# EAGLE design Main (EAGLE 6.5.0)
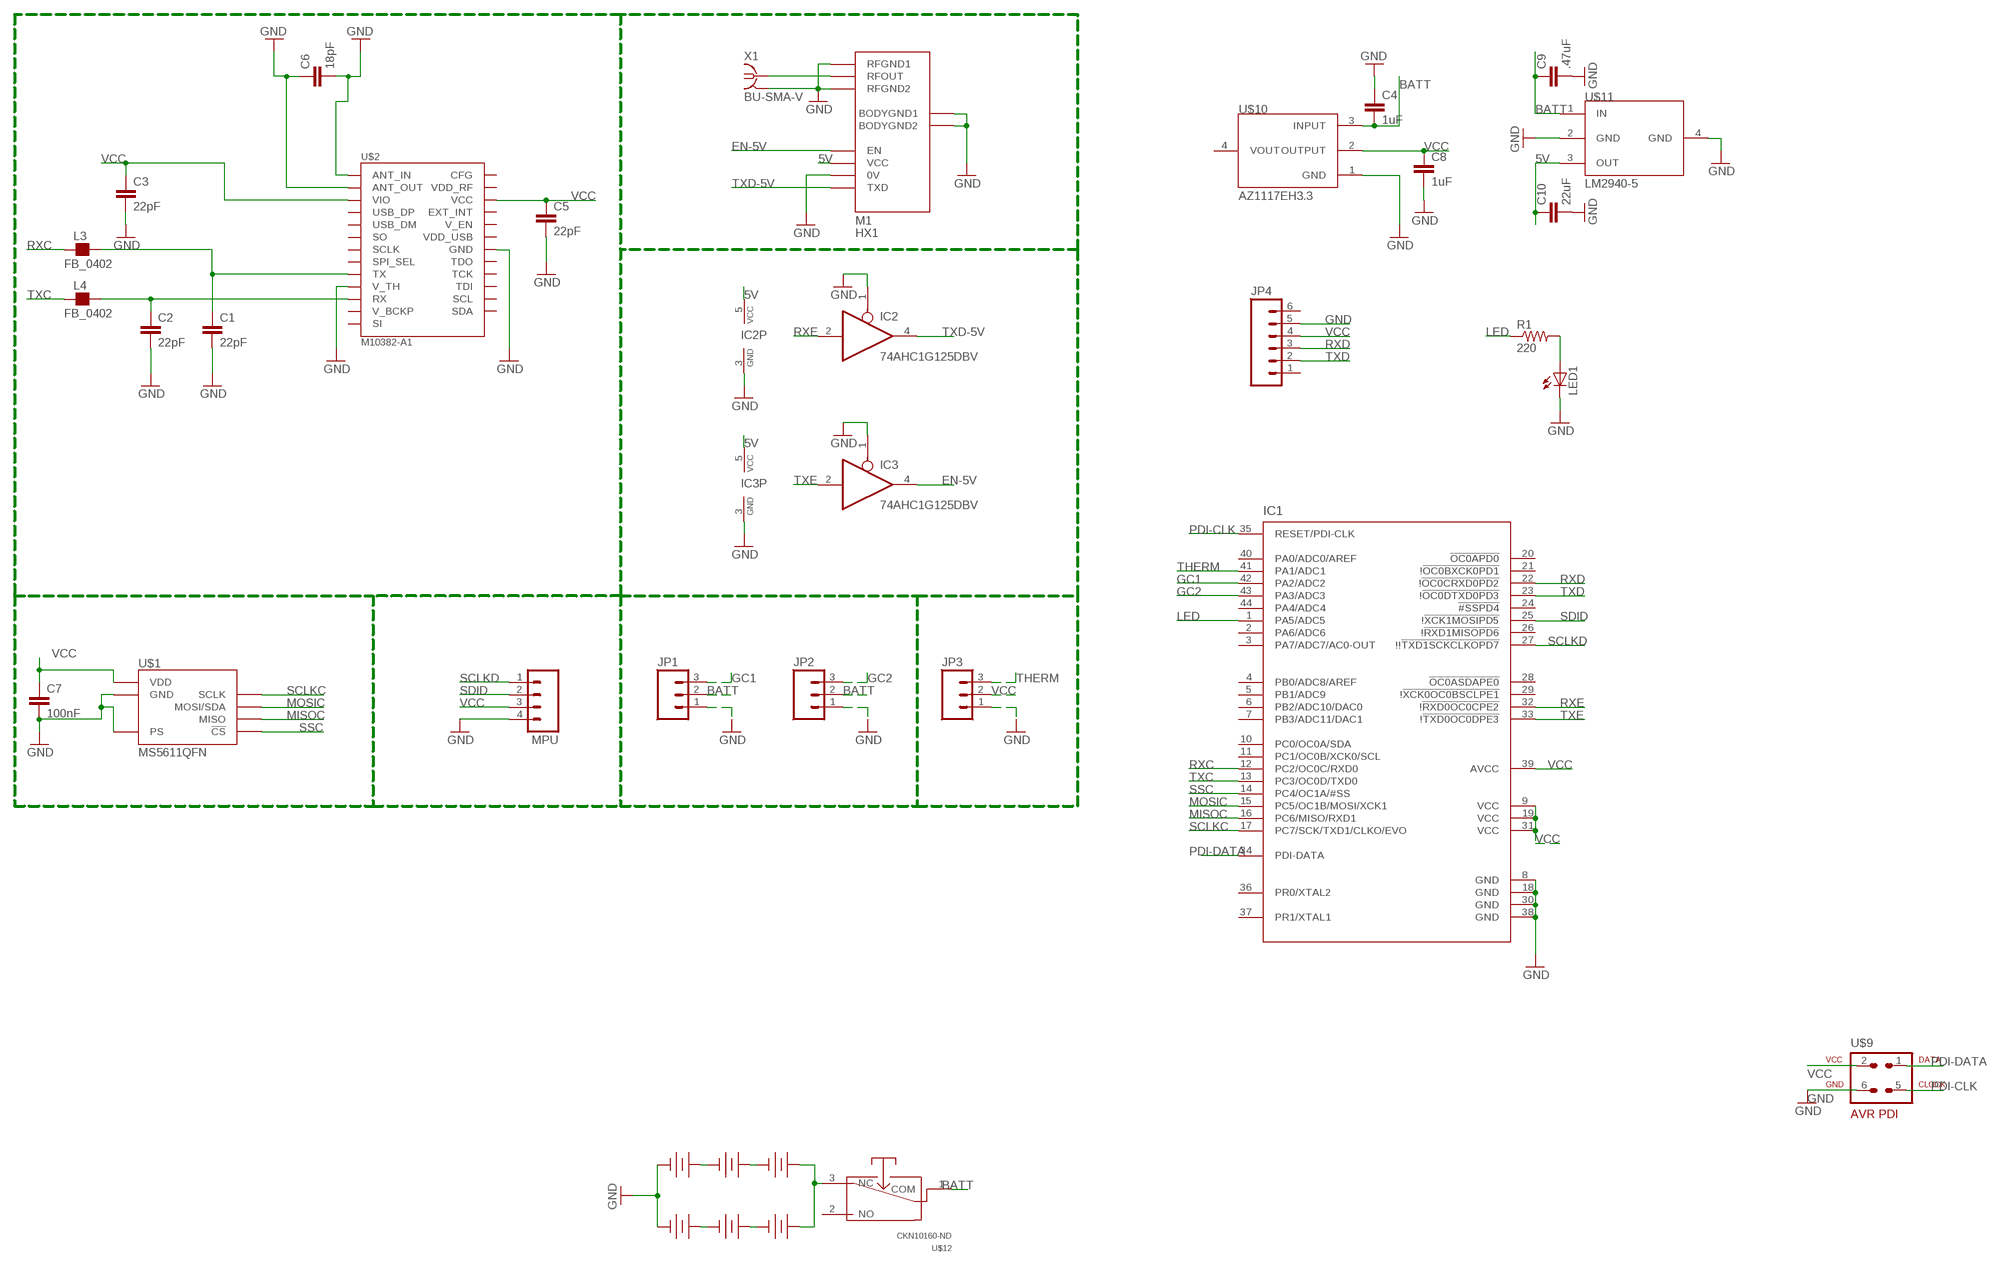
[diagram p0: schematic, sheet 1]

## Parts
C1  22pF  CAP0805  [0805]
C2  22pF  CAP0805  [0805]
C3  22pF  CAP0805  [0805]
C4  1uF  CAP0603-CAP  [0603-CAP]
C5  22pF  CAP0805  [0805]
C6  18pF  CAP0805  [0805]
C7  100nF  CAP0805  [0805]
C8  1uF  CAP0603-CAP  [0603-CAP]
C9  .47uF  CAP0603-CAP  [0603-CAP]
C10  22uF  CAP0603-CAP  [0603-CAP]
IC1  AT-XMEGA-XXA4-AU  [QFP80P1200X1200X120-44N]
IC2  74AHC1G125DBV  [SOT23-5]
IC3  74AHC1G125DBV  [SOT23-5]
JP1  M03JST-PTH  [JST-3-PTH]
JP2  M03JST-PTH  [JST-3-PTH]
JP3  M03JST-PTH  [JST-3-PTH]
JP4  M06POLAR  [MOLEX-1X6]
L3  FB_0402  [L0402]
L4  FB_0402  [L0402]
LED1  LEDCHIP-LED0603  [CHIP-LED0603]
M1  HX1  [HX1]
MPU  M04  [04P]
R1  220  R-US_R0603  [R0603]
U$1  MS5611QFN  [MS5611-01BA01]
U$2  M10382-A1  [M10382-A1]
U$3  123_BATTERY_HOLDERCR-123-A  [CR-123-A_HOLDER]
U$4  123_BATTERY_HOLDERCR-123-A  [CR-123-A_HOLDER]
U$5  123_BATTERY_HOLDERCR-123-A  [CR-123-A_HOLDER]
U$6  123_BATTERY_HOLDERCR-123-A  [CR-123-A_HOLDER]
U$7  123_BATTERY_HOLDERCR-123-A  [CR-123-A_HOLDER]
U$8  123_BATTERY_HOLDERCR-123-A  [CR-123-A_HOLDER]
U$9  AVR-PDIVERT  [AVR-ISP-6]
U$10  AZ1117EH3.3  [SOT-223]
U$11  LM2940-5  [SOT-223]
U$12  CKN10160-ND  [ZMCHFL3R]
X1  BU-SMA-V  [BU-SMA-V]

## Nets
5V: C10.1 IC2.5(VCC) IC3.5(VCC) M1.VCC U$11.3(OUT)
BATT: C4.2 C9.1 JP1.2 JP2.2 U$10.3(INPUT) U$11.1(IN) U$12.1(COM)
EN-5V: IC3.4(O) M1.EN
GC1: IC1.42(PA2/ADC2) JP1.3
GC2: IC1.43(PA3/ADC3) JP2.3
GND: C1.2 C2.2 C3.2 C4.1 C5.2 C6.1 C6.2 C7.2 C8.2 C9.2 C10.2 IC1.8(GND) IC1.18(GND) IC1.30(GND) IC1.38(GND) IC2.1(OE) IC2.3(GND) IC3.1(OE) IC3.3(GND) JP1.1 JP2.1 JP3.1 JP4.5 LED1.C M1.0V M1.BODYGND1 M1.BODYGND2 M1.RFGND1 M1.RFGND2 MPU.4 U$1.2(PS) U$1.3(GND) U$2.1(ANT_IN) U$2.2(GND) U$2.3(ANT_OUT) U$2.4(GND) U$2.12(V_TH) U$2.14(GND) U$2.17(GND) U$2.21(GND) U$2.24(GND) U$2.26(GND) U$2.28(GND) U$2.33(GND) U$2.34(GND) U$2.35(GND) U$2.36(GND) U$3.- U$6.- U$9.6 U$10.1(GND) U$11.2(GND) U$11.4(GND) X1.2(GND)
LED: IC1.1(PA5/ADC5) R1.1
MISOC: IC1.16(PC6/MISO/RXD1) U$1.6(MISO)
MOSIC: IC1.15(PC5/OC1B/MOSI/XCK1) U$1.7(MOSI/SDA)
N$1: C1.1 L3.2 U$2.11(TX)
N$2: C2.1 L4.2 U$2.13(RX)
N$4: U$3.+ U$4.-
N$5: M1.RFOUT X1.1
N$6: U$4.+ U$5.-
N$7: U$5.+ U$8.+ U$12.3(NC)
N$8: U$6.+ U$7.-
N$9: U$7.+ U$8.-
N$11: LED1.A R1.2
PDI-CLK: IC1.35(RESET/PDI-CLK) U$9.5
PDI-DATA: IC1.34(PDI-DATA) U$9.1
RXC: IC1.12(PC2/OC0C/RXD0) L3.1
RXD: IC1.22(!!OC0CRXD0PD2) JP4.3
RXE: IC1.32(!!RXD0OC0CPE2) IC2.2(I)
SCLKC: IC1.17(PC7/SCK/TXD1/CLKO/EVO) U$1.8(SCLK)
SCLKD: IC1.27(!!!TXD1SCKCLKOPD7) MPU.1
SDID: IC1.25(!!XCK1MOSIPD5) MPU.2
SSC: IC1.14(PC4/OC1A/#SS) U$1.4(!CS!) U$1.5(!CS!)
THERM: IC1.41(PA1/ADC1) JP3.3
TXC: IC1.13(PC3/OC0D/TXD0) L4.1
TXD: IC1.23(!!OC0DTXD0PD3) JP4.2
TXD-5V: IC2.4(O) M1.TXD
TXE: IC1.33(!!TXD0OC0DPE3) IC3.2(I)
VCC: C3.1 C5.1 C7.1 C8.1 IC1.9(VCC) IC1.19(VCC) IC1.31(VCC) IC1.39(AVCC) JP3.2 JP4.4 MPU.3 U$1.1(VDD) U$2.5(VIO) U$2.27(VCC) U$9.2 U$10.2(OUTPUT)
Unconnected: IC1.2(PA6/ADC6) IC1.3(PA7/ADC7/AC0-OUT) IC1.4(PB0/ADC8/AREF) IC1.5(PB1/ADC9) IC1.6(PB2/ADC10/DAC0) IC1.7(PB3/ADC11/DAC1) IC1.10(PC0/OC0A/SDA) IC1.11(PC1/OC0B/XCK0/SCL) IC1.20(!OC0APD0) IC1.21(!!OC0BXCK0PD1) IC1.24(!#SSPD4) IC1.26(!!RXD1MISOPD6) IC1.28(!OC0ASDAPE0) IC1.29(!!XCK0OC0BSCLPE1) IC1.36(PR0/XTAL2) IC1.37(PR1/XTAL1) IC1.40(PA0/ADC0/AREF) IC1.44(PA4/ADC4) JP4.1 JP4.6 U$2.6(USB_DP) U$2.7(USB_DM) U$2.8(SO) U$2.9(SCLK) U$2.10(SPI_SEL) U$2.15(V_BCKP) U$2.16(SI) U$2.18(SDA) U$2.19(SCL) U$2.20(TDI) U$2.22(TCK) U$2.23(TDO) U$2.25(VDD_RF) U$2.29(EXT_INT) U$2.30(V_EN) U$2.31(CFG) U$2.32(VDD_USB) U$10.4(VOUT) U$12.2(NO)

## Power pins joined to a net without a drawn wire
GND: X1.3(GND) X1.4(GND) X1.5(GND)

## Library data of the parts
C1-C10 = SparkFun:CAP: Capacitor Standard 0603 ceramic capacitor, and 0.1" leaded capacitor.
IC1 = xmega-a4:AT-XMEGA-XXA4-AU: ATxMega a4 Serie
IC2 IC3 = 74xx-little-us:74*1G125: Single Bus Buffer Gate with 3-State Output
JP1-JP3 = SparkFun-Connectors:M03: Header 3 Standard 3-pin 0.1" header. Use with straight break away headers (SKU : PRT-00116), right angle break away headers (PRT-00553), swiss pins (PRT-00743), machine pins (PRT-00117), and female headers (PRT-00115). Molex polarized connector foot print use with SKU : PRT-08232 with associated crimp pins and housings.
JP4 = SparkFun:M06: Header 6 Standard 6-pin 0.1" header. Use with straight break away headers (SKU : PRT-00116), right angle break away headers (PRT-00553), swiss pins (PRT-00743), machine pins (PRT-00117), and female headers (PRT-00115). Molex polarized connector foot print use with SKU : PRT-08094 with associated crimp pins and housings. NOTES ON THE VARIANTS LOCK and LOCK_LONGPADS... This footprint was designed to help hold the alignment of a through-hole component (i.e. 6-pin header) while soldering it into place. You may notice that each hole has been shifted either up or down by 0.005 of an inch from it's more standard position (which is a perfectly straight line). This slight alteration caused the pins (the squares in the middle) to touch the edges of the holes. Because they are alternating, it causes a "brace" to hold the component in place. 0.005 has proven to be the perfect amount of "off-center" position when using our standard breakaway headers. Although looks a little odd when you look at the bare footprint, once you have a header in there, the alteration is very hard to notice. Also, if you push a header all the way into place, it is covered up entirely on the bottom side. This idea of altering the position of holes to aid alignment will be further integrated into the Sparkfun Library for other footprints. It can help hold any component with 3 or more connection pins.
L3 L4 = rc-master-smd:FB_: FERRITE BEAD
LED1 = led:LED: LED OSRAM: - CHIPLED LG R971, LG N971, LY N971, LG Q971, LY Q971, LO R971, LY R971 LH N974, LH R974 LS Q976, LO Q976, LY Q976 LO Q996 - Hyper CHIPLED LW Q18S LB Q993, LB Q99A, LB R99A - SideLED LS A670, LO A670, LY A670, LG A670, LP A670 LB A673, LV A673, LT A673, LW A673 LH A674 LY A675 LS A676, LA A676, LO A676, LY A676, LW A676 LS A679, LY A679, LG A679 - Hyper Micro SIDELED® LS Y876, LA Y876, LO Y876, LY Y876 LT Y87S - SmartLED LW L88C, LW L88S LB L89C, LB L89S, LG L890 LS L89K, LO L89K, LY L89K LS L896, LA L896, LO L896, LY L896 - TOPLED LS T670, LO T670, LY T670, LG T670, LP T670 LSG T670, LSP T670, LSY T670, LOP T670, LYG T670 LG T671, LOG T671, LSG T671 LB T673, LV T673, LT T673, LW T673 LH T674 LS T676, LA T676, LO T676, LY T676, LB T676, LH T676, LSB T676, LW T676 LB T67C, LV T67C, LT T67C, LS T67K, LO T67K, LY T67K, LW E67C LS E67B, LA E67B, LO E67B, LY E67B, LB E67C, LV E67C, LT E67C LW T67C LS T679, LY T679, LG T679 LS T770, LO T770, LY T770, LG T770, LP T770 LB T773, LV T773, LT T773, LW T773 LH T774 LS E675, LA E675, LY E675, LS T675 LS T776, LA T776, LO T776, LY T776, LB T776 LHGB T686 LT T68C, LB T68C - Hyper Mini TOPLED® LB M676 - Mini TOPLED Santana® LG M470 LS M47K, LO M47K, LY M47K Source: http://www.osram.convergy.de LUXEON: - LUMILED® LXK2-PW12-R00, LXK2-PW12-S00, LXK2-PW14-U00, LXK2-PW14-V00 LXK2-PM12-R00, LXK2-PM12-S00, LXK2-PM14-U00 LXK2-PE12-Q00, LXK2-PE12-R00, LXK2-PE12-S00, LXK2-PE14-T00, LXK2-PE14-U00 LXK2-PB12-K00, LXK2-PB12-L00, LXK2-PB12-M00, LXK2-PB14-N00, LXK2-PB14-P00, LXK2-PB14-Q00 LXK2-PR12-L00, LXK2-PR12-M00, LXK2-PR14-Q00, LXK2-PR14-R00 LXK2-PD12-Q00, LXK2-PD12-R00, LXK2-PD12-S00 LXK2-PH12-R00, LXK2-PH12-S00 LXK2-PL12-P00, LXK2-PL12-Q00, LXK2-PL12-R00 Source: www.luxeon.com KINGBRIGHT: KA-3528ASYC Source: www.kingbright.com
M1 = trackuino:HX1
MPU = con-amp-quick:M04: AMP QUICK CONNECTOR; OC_FARNELL: unknown; OC_NEWARK: unknown
R1 = rcl:R-US_: RESISTOR, American symbol
U$1 = SHC:MS5611
U$2 = SHC:M10382-A1: Antenova’s GPS RADIONOVA® M10382 is a single package solution that combines a full GPS engine and antenna on a small SMD module. The M10382 is a highly integrated GPS RF Antenna Module suitable for L1-band GPS and A-GPS systems. The device combines the high performance u-blox 6 GPS position engine with Antenova’s high efficiency antenna technology in a small SMD module. M10382 also benefits from novel external matching that ensures easy tuning for each platform. All front-end and receiver components are contained in a single package laminate base module, providing a complete GPS receiver for optimum performance. The M10382 operates on 1.8V or 3.3V positive supply with low power consumption and several low power modes for further power savings. An accurate 0.5ppm TCXO and very low noise LNA ensures high sensitivity and short TTFF. The M10382 is supported by u-blox stand alone software and is compatible with UART, SPI, DDC, I2C and USB host processor interfaces.
U$3-U$8 = SHC:123_BATTERY_HOLDER
U$9 = avr-7:AVR-PDI: AVR PDI programming interface connector
U$10 = Physoon:AZ1117EH
U$11 = Physoon:LM2940
U$12 = SHC:CKN10160-ND: CONTACT RATING: F7: 3A @ 125 VAC ELECTRICAL LIFE: 15,000 Cycles. @ 3A INSULATION RESISTANCE: 100 M ohm min. DIELECTRIC STRENGTH: 1000 Vrms. OPERATING TEMPERATURE: ?30ºC to 85ºC. OPERATING FORCE: CJ: 150 grams, CH: 90 grams.
X1 = con-coax:BU-SMA-V: FEMALE SMA CONNECTOR Radiall distributor RS 112-3794; OC_FARNELL: unknown; OC_NEWARK: unknown

## Board
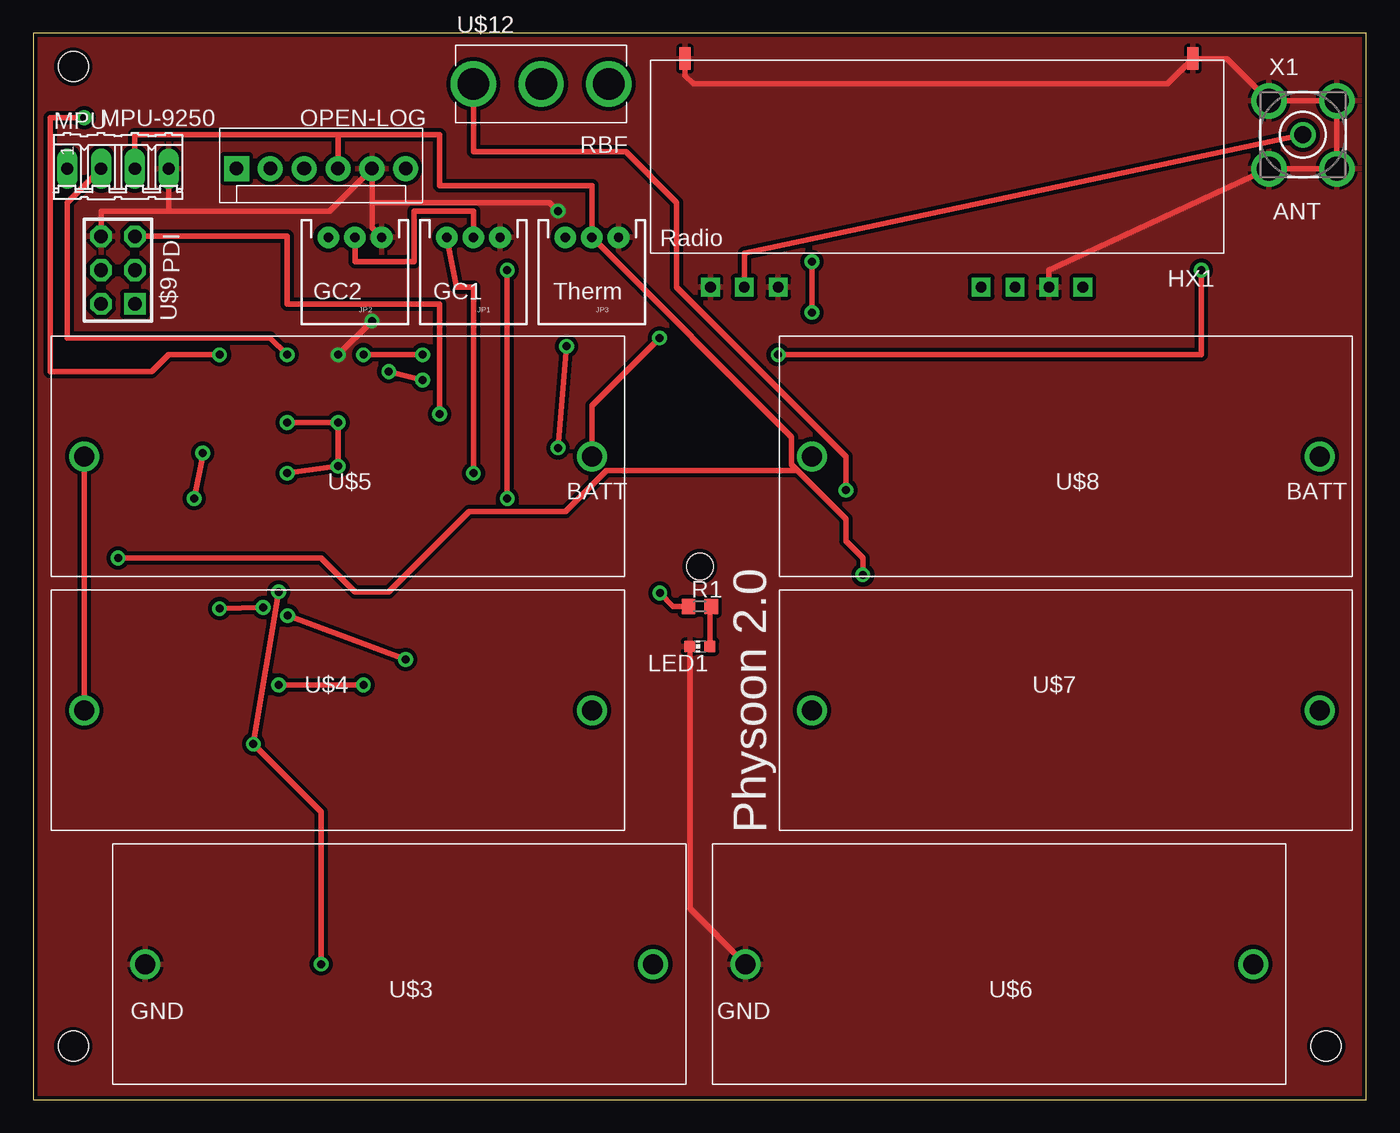
[diagram p1: board, top side]
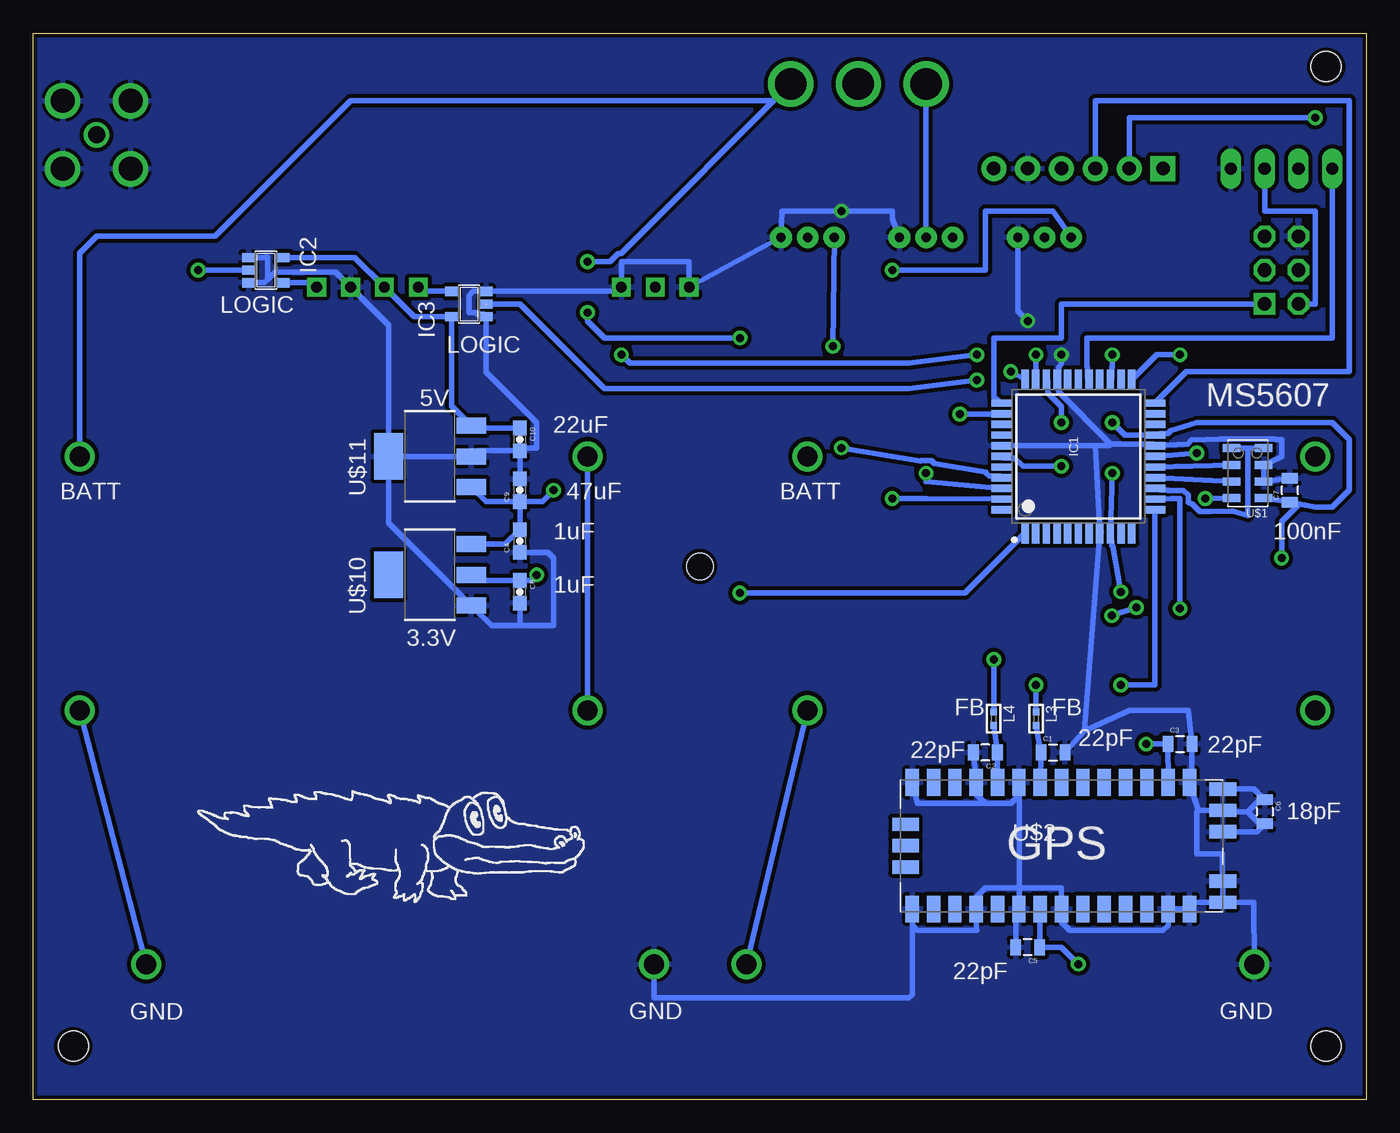
[diagram p2: board, bottom side, seen from below]

Size 100 x 80 mm. Coordinates in mm from the lower left corner, seen from the top.
Outline: 0,0 100,0 100,80 0,80 0,0
Copper layers (1*16): Top 0.035mm / dielectric 1.5mm / Bottom 0.035mm
Design rules "SparkFun": minimum track width 8mil, minimum drill 20mil, track to track 8mil, track to pad 8mil, pad to pad 8mil, via to via 8mil, smd to smd 8mil, copper to edge 8mil, drill to drill 8mil, minimum pad ring 12mil, minimum via ring 10mil, stop-mask expansion 4mil, vias tented up to drill 20mil, thermal gap 10mil
Holes 2.26 mm at 3,4 97,4 3,77.5
Holes 2 mm at 50,40

### Footprints (pad centres in the part's own frame; a part is rotated, then mirrored left to right if it is on the bottom)
0805 = smd 0.8 x 1.2: 1 -0.9,0; 2 0.9,0
0603-CAP = smd 1.1 x 1: 1 -0.85,0; 2 0.85,0
QFP80P1200X1200X120-44N = smd 1.55 x 0.55: 1 -5.75,4; 2 -5.75,3.2; 3 -5.75,2.4; 4 -5.75,1.6; 5 -5.75,0.8; 6 -5.75,0; 7 -5.75,-0.8; 8 -5.75,-1.6; 9 -5.75,-2.4; 10 -5.75,-3.2; 11 -5.75,-4; 23 5.75,-4; 24 5.75,-3.2; 25 5.75,-2.4; 26 5.75,-1.6; 27 5.75,-0.8; 28 5.75,0; 29 5.75,0.8; 30 5.75,1.6; 31 5.75,2.4; 32 5.75,3.2; 33 5.75,4 | smd 0.55 x 1.55: 12 -4,-5.75; 13 -3.2,-5.75; 14 -2.4,-5.75; 15 -1.6,-5.75; 16 -0.8,-5.75; 17 0,-5.75; 18 0.8,-5.75; 19 1.6,-5.75; 20 2.4,-5.75; 21 3.2,-5.75; 22 4,-5.75; 34 4,5.75; 35 3.2,5.75; 36 2.4,5.75; 37 1.6,5.75; 38 0.8,5.75; 39 0,5.75; 40 -0.8,5.75; 41 -1.6,5.75; 42 -2.4,5.75; 43 -3.2,5.75; 44 -4,5.75
SOT23-5 = smd 0.69 x 0.99: 1 -0.95,-1.29; 2 0,-1.29; 3 0.95,-1.29; 4 0.95,1.3; 5 -0.95,1.3
JST-3-PTH = drill 0.7 pad 1.626: 1 -2,-5; 2 0,-5; 3 2,-5
MOLEX-1X6 = drill 1.016 pad 1.88 square: 1 0,0 | drill 1.016 pad 1.88: 2 2.54,0; 3 5.08,0; 4 7.62,0; 5 10.16,0; 6 12.7,0
L0402 = smd 0.5 x 0.5: 1 -0.508,0; 2 0.508,0
CHIP-LED0603 = smd 0.8 x 0.8: A 0,-0.75; C 0,0.75
HX1 = drill 0.8 square: 0V 25.4,-8.89; EN 20.32,-8.89; RFGND1 0,-8.89; RFGND2 5.08,-8.89; RFOUT 2.54,-8.89; TXD 27.94,-8.89; VCC 22.86,-8.89 | smd 0.813 x 1.676: BODYGND1 -1.905,8.255; BODYGND2 36.195,8.255
04P = drill 0.914 long: 1 -3.81,0; 2 -1.27,0; 3 1.27,0; 4 3.81,0
R0603 = smd 1 x 1.1: 1 -0.85,0; 2 0.85,0
MS5611-01BA01 = smd 1.3 x 0.6: 1 -1.2,1.875; 2 -1.2,0.625; 3 -1.2,-0.625; 4 -1.2,-1.875; 5 1.2,-1.875; 6 1.2,-0.625; 7 1.2,0.625; 8 1.2,1.875
M10382-A1 = smd 1 x 2: 1 -1.05,12.1; 2 -2.65,12.1; 3 -4.25,12.1; 18 -1.6,-11.7; 19 0,-11.7; 20 1.6,-11.7; 35 4.25,12.1; 36 2.65,12.1 | smd 2 x 1: 4 -4.75,9.6; 5 -4.75,8; 6 -4.75,6.4; 7 -4.75,4.8; 8 -4.75,3.2; 9 -4.75,1.6; 10 -4.75,0; 11 -4.75,-1.6; 12 -4.75,-3.2; 13 -4.75,-4.8; 14 -4.75,-6.4; 15 -4.75,-8; 16 -4.75,-9.6; 17 -4.75,-11.2; 21 4.75,-11.2; 22 4.75,-9.6; 23 4.75,-8; 24 4.75,-6.4; 25 4.75,-4.8; 26 4.75,-3.2; 27 4.75,-1.6; 28 4.75,0; 29 4.75,1.6; 30 4.75,3.2; 31 4.75,4.8; 32 4.75,6.4; 33 4.75,8; 34 4.75,9.6
CR-123-A_HOLDER = drill 1.5: + -19.05,0; - 19.05,0
AVR-ISP-6 = drill 1.016 square: 1 -2.54,-1.27 | drill 1.016 octagon: 2 -2.54,1.27; 3 0,-1.27; 4 0,1.27; 5 2.54,-1.27; 6 2.54,1.27
SOT-223 = smd 1.2 x 2.2: 1 -2.3,1.1; 2 0,1.1; 3 2.3,1.1 | smd 3.5 x 2.2: 4 0,7.3
ZMCHFL3R = drill 2.375: 1 -5.08,0; 2 0,0; 3 5.08,0
BU-SMA-V = drill 1.27: 1 0,0 | drill 1.778: 2 -2.55,2.55; 3 2.55,2.55; 4 2.55,-2.55; 5 -2.55,-2.55

### Placement (x,y rotation side)
C1  23.5,26.04 0 bottom
C2  28.57,26.04 180 bottom
C3  13.97,26.67 0 bottom
C4  63.5,41.91 90 bottom
C5  25.4,11.43 180 bottom
C6  7.62,21.59 270 bottom
C7  5.71,45.72 90 bottom
C8  63.5,38.1 270 bottom
C9  63.5,45.72 90 bottom
C10  63.5,49.53 270 bottom
IC1  21.59,48.26 90 bottom
IC2  82.55,62.23 270 bottom
IC3  67.31,59.69 90 bottom
JP1  33.02,59.69 180 top
JP2  24.13,59.69 180 top
JP3  41.91,59.69 180 top
JP4  15.24,69.85 0 top
L3  24.77,28.57 270 bottom
L4  27.94,28.57 270 bottom
LED1  50,34 90 top
M1  50.8,69.85 0 top
MPU  6.35,69.85 0 top
R1  50,37 0 top
U$1  8.89,46.99 180 bottom
U$2  22.86,19.05 270 bottom
U$3  27.46,10.16 180 top
U$4  22.86,29.21 0 top
U$5  22.86,48.26 180 top
U$6  72.47,10.16 180 top
U$7  77.47,29.21 0 top
U$8  77.47,48.26 180 top
U$9  6.35,62.23 90 top
U$10  66.04,39.37 90 bottom
U$11  66.04,48.26 90 bottom
U$12  38.1,76.2 0 top
X1  95.25,72.39 0 top

### Tracks (layer width: path | path; a pad name or v marks a point on that pad's centre or on a via)
5V
  Bottom 0.406: C10.1 66.96,50.38 U$11.3 68.61,52.03 IC3.5 71.44,58.74 M1.VCC 75.88,63.18 IC2.5
BATT  (via drill 0.6)
  Top 0.406: JP1.2 33.02,66.67 28.57,66.67 28.57,62.87 24.13,62.87 JP2.2 | v60.96,45.72 60.96,48.26 48.26,60.96 48.26,67.31 44.45,71.12 33.02,71.12 U$12.1
  Bottom 0.406: U$12.1 JP1.2 | U$10.3 64.59,41.67 C4.2 C9.1 | C9.1 66.05,44.87 U$11.1 | C9.1 61.81,44.87 v60.96,45.72
EN-5V
  Bottom 0.406: IC3.4 70.8,60.64 M1.EN
GC1  (via drill 0.6)
  Top 0.406: v33.02,46.99 33.02,60.96 31.75,60.96 JP1.3
  Bottom 0.406: IC1.42 33.02,46.35 v33.02,46.99
GC2  (via drill 0.6)
  Top 0.406: v35.56,45.09 v35.56,62.23
  Bottom 0.406: IC1.43 33.02,45.09 v35.56,45.09 | v35.56,62.23 28.57,62.23 28.57,66.67 23.5,66.67 JP2.3
GND  (via drill 0.6)
  Top 0.406: MPU.4 10.16,66.67 | 10.16,66.67 5.08,66.67 U$9.6 | 10.16,66.67 22.23,66.67 JP4.5 25.4,67.31 | 25.4,67.31 25.4,65.42 JP2.1 | v25.4,58.42 v22.86,55.88 | M1.0V 76.2,62.23 X1.5 X1.4 X1.3 X1.2 89.53,78.11 M1.BODYGND2 85.09,76.2 49.53,76.2 48.9,76.83 M1.BODYGND1 | 25.4,67.31 38.73,67.31 v39.37,66.67 | LED1.C 49.25,14.33 U$6.-
  Bottom 0.406: U$2.3 8.43,23.3 C6.1 7.99,22.49 8.89,21.59 | U$2.1 8.21,20.1 C6.2 7.99,20.69 8.89,21.59 | 12.59,21.7 U$2.2 10.65,21.59 8.89,21.59 | 12.59,21.7 12.7,21.59 12.7,18.41 10.79,18.41 10.79,16.43 U$2.36 U$2.35 | U$2.35 8.45,14.8 U$3.- | U$2.35 12.76,14.8 U$2.34 U$2.33 14.86,13.08 15.24,12.7 22.23,12.7 22.86,13.34 U$2.28 22.86,15.88 26.04,15.88 | 29.26,12.75 U$2.24 29.21,14.35 29.21,15.24 28.57,15.88 26.04,15.88 | 29.26,12.75 29.21,12.7 | U$2.21 34.06,13.11 | 34.06,13.11 33.66,12.7 29.31,12.7 29.26,12.75 | 34.06,13.11 34.06,7.85 34.29,7.62 53.42,7.62 U$6.- | U$2.14 29.21,23.85 | 26.04,23.82 U$2.12 | 26.04,15.88 26.04,14.32 U$2.26 26.3,14.06 C5.2 | 26.04,15.88 26.04,23.77 U$2.12 | U$2.12 26.06,22.84 26.67,22.23 28.57,22.23 | 28.57,22.23 29.21,22.86 29.21,23.75 U$2.14 | U$2.17 33.66,22.23 28.57,22.23 | C1.2 21.13,27.66 | 21.13,27.66 17.78,29.21 13.34,29.21 C3.2 13.07,23.99 U$2.4 12.59,21.7 | C2.2 U$2.14 | IC1.8 21.13,27.66 | JP2.1 26.13,59.15 v25.4,58.42 | v22.86,55.88 22.86,55.16 23.07,54.95 23.07,54.13 IC1.30 23.07,53.89 23.07,53.07 19.18,49.18 | 19.18,49.18 15.96,49.18 IC1.18 13.39,49.18 13.1,49.47 10.97,49.57 6.87,49.57 6.81,49.51 6.35,49.53 6.35,48.26 U$1.3 U$1.2 C7.2 | 19.87,42.63 IC1.8 | IC1.38 20.32,49.06 | 20.32,49.06 19.3,49.06 19.18,49.18 | 20.32,49.06 IC1.8 | JP1.1 35.56,66.04 35.56,66.67 v39.37,66.67 43.81,66.67 JP3.1 M1.RFGND1 50.8,62.87 55.88,62.87 M1.RFGND2 56.2,60.64 IC3.3 67,60.64 67.31,60.33 67.31,59.05 66.8,59.05 66.68,58.94 66.22,58.94 IC3.1 66.02,54.59 62.23,50.8 62.23,48.9 63.28,48.9 C10.2 | 63.5,35.56 C8.2 | 63.5,35.56 65.63,35.56 U$10.1 73.34,43.27 U$11.4
  Bottom 0.406: C4.1 61.38,41.06 60.96,40.64 60.96,35.56 63.5,35.56 | C10.2 66.72,48.68 U$11.2 U$11.4 | C9.2 C10.2 | IC2.3 82.67,61.28 82.42,61.52 | 82.42,61.52 81.87,62.07 77.31,62.07 M1.0V 73.34,58.1 U$11.4 | IC2.1 82.6,63.18 82.6,63.2 82.42,63.2 82.42,61.52
  pour Top (isolate 0.305): 0,80.01 100,80.01 100,0 0,0
  pour Bottom (isolate 0.305): 0,80 100,80 100,0 0,0
LED  (via drill 0.6)
  Top 0.406: R1.1 48,37 v47,38
  Bottom 0.406: v47,38 30.1,38 IC1.1
MISOC
  Bottom 0.406: U$1.6 IC1.16
MOSIC
  Bottom 0.406: U$1.7 IC1.15
N$1
  Bottom 0.406: U$2.11 C1.1 L3.2
N$2
  Bottom 0.406: U$2.13 C2.1 L4.2
N$4
  Bottom 0.406: U$3.+ U$4.-
N$5
  Top 0.406: X1.1 53.34,63.5 M1.RFOUT
N$6
  Top 0.406: U$4.+ U$5.-
N$7  (via drill 0.6)
  Top 0.406: U$5.+ 41.91,52.07 v46.99,57.15 | v58.42,59.05 v58.42,62.87
  Bottom 0.406: U$8.+ 96.52,63.5 95.25,64.77 86.36,64.77 76.2,74.93 44.45,74.93 U$12.3 55.91,63.48 56.13,63.48 56.74,62.87 v58.42,62.87 | v46.99,57.15 57.15,57.15 58.42,58.42 v58.42,59.05
N$8
  Bottom 0.406: U$7.- U$6.+
N$9
  Bottom 0.406: U$7.+ U$8.-
N$11
  Top 0.406: LED1.A 50.75,36.9 R1.2
PDI-CLK  (via drill 0.6)
  Top 0.406: U$9.5 19.05,64.77 19.05,59.69 30.48,59.69 v30.48,51.44
  Bottom 0.406: v30.48,51.44 27.36,51.44 IC1.35
PDI-DATA
  Bottom 0.406: U$9.1 22.86,59.69 22.86,57.15 27.94,57.15 27.94,52.7 IC1.34
RXC  (via drill 0.6)
  Top 0.406: v18.41,31.11 v24.77,31.11
  Bottom 0.406: IC1.12 15.88,31.11 v18.41,31.11 | v24.77,31.11 L3.1
RXD
  Bottom 0.406: JP4.3 20.32,74.93 1.27,74.93 1.27,54.61 13.49,54.61 IC1.22
RXE  (via drill 0.6)
  Top 0.406: v24.77,55.88 v29.21,55.88 | v55.88,55.88 87.63,55.88 v87.63,62.23
  Bottom 0.406: IC1.32 v24.77,55.88 | v29.21,55.88 34.29,55.24 55.24,55.24 v55.88,55.88 | v87.63,62.23 IC2.2
SCLKC  (via drill 0.6)
  Top 0.406: v12.06,45.09 12.7,48.26 v12.71,48.51
  Bottom 0.406: U$1.8 v12.06,45.09 | v12.71,48.51 IC1.17
SCLKD
  Bottom 0.406: MPU.1 2.54,57.15 20.95,57.15 20.95,55 20.91,54.95 20.91,54.13 IC1.27
SDID  (via drill 0.6)
  Top 0.406: MPU.2 2.54,67.31 2.54,57.15 17.78,57.15 v19.05,55.88
  Bottom 0.406: v19.05,55.88 19.05,54.98 19.07,54.95 19.07,54.13 IC1.25
SSC
  Bottom 0.406: U$1.5 8.89,48.87 | 8.89,48.87 U$1.4 | 8.89,48.87 8.89,43.81 10.03,44.15 11.67,44.12 12.46,44.12 13.03,44.69 13.36,44.79 13.36,45.34 13.72,45.7 14.36,45.7 14.37,45.7 14.61,45.7 14.85,45.7 14.9,45.74 15.44,45.74 IC1.14
THERM  (via drill 0.6)
  Top 0.406: v40.01,56.52 v39.37,48.9
  Bottom 0.406: JP3.3 v40.01,56.52 | v39.37,48.9 33.46,47.91 33.42,47.95 32.62,47.95 32.41,47.73 28.52,47.09 | 28.52,47.09 28.52,47.02 | 28.52,47.09 28.52,47.02 | 28.52,47.02 28.28,46.78 27.46,46.78 IC1.41
TXC  (via drill 0.6)
  Top 0.406: v13.97,36.83 v17.25,36.92 | v19.09,36.31 v27.94,33.02
  Bottom 0.406: IC1.13 14.61,45.09 13.97,45.09 v13.97,36.83 | v17.25,36.92 v19.09,36.31 | v27.94,33.02 L4.1
TXD  (via drill 0.6)
  Top 0.406: v3.81,73.66 1.27,73.66 1.27,54.61 8.89,54.61 10.16,55.88 v13.97,55.88
  Bottom 0.406: JP4.2 17.78,73.66 v3.81,73.66 | v13.97,55.88 15.72,55.88 IC1.23
TXD-5V
  Bottom 0.406: IC2.4 79.06,61.28 M1.TXD
TXE  (via drill 0.6)
  Top 0.406: v26.67,54.61 v29.21,53.98
  Bottom 0.406: IC1.33 v26.67,54.61 | v29.21,53.98 34.29,53.34 57.15,53.34 63.5,59.69 IC3.2
VCC  (via drill 0.6)
  Top 0.406: v21.59,10.16 21.59,21.59 v16.51,26.67 v18.41,38.1 | JP4.4 22.86,72.39 | 22.86,72.39 7.62,72.39 MPU.3 | 22.86,72.39 30.48,72.39 30.48,68.58 41.91,68.58 JP3.2 56.89,49.71 56.89,47.63 57.34,47.18 | v19.05,50.8 v22.86,50.8 v22.86,47.52 v19.05,46.99 | v62.23,39.37 62.23,40.64 60.96,41.91 60.96,43.55 57.34,47.18 | 57.34,47.18 42.99,47.18 39.94,44.12 32.7,44.12 26.67,38.1 24.13,38.1 21.59,40.64 v6.35,40.64
  Bottom 0.406: U$2.27 24.5,14.26 C5.1 22.86,11.43 v21.59,10.16 | v16.51,26.67 C3.1 U$2.5 | v18.41,38.1 19.01,41.51 19.07,41.57 19.07,41.84 IC1.9 v19.05,46.99 | MPU.3 7.62,66.67 3.81,66.67 3.81,59.69 U$9.2 | v19.05,50.8 18.11,49.86 IC1.19 15.44,49.98 14.9,49.98 14.66,50.21 12.7,50.8 2.54,50.8 1.27,49.53 1.27,45.72 2.54,44.45 3.81,44.45 5.03,44.69 | 27.23,48.15 IC1.39 27.22,48.14 26.4,48.14 25.77,47.52 v22.86,47.52 | v22.86,50.8 22.86,51.99 23.87,53.01 23.87,53.89 IC1.31 | U$1.1 C7.1 5.03,44.69 | U$10.2 66.72,38.95 C8.1 62.65,38.95 v62.23,39.37 | v6.35,40.64 6.35,43.37 5.03,44.69

### Text on the board
Dimension: C:/Users/cw0063/Downloads/croc.bmp
tPlace: MPU-9250 | OPEN-LOG | RBF | ANT | Radio | PDI | GC2 | GC1 | Therm | BATT | BATT | Physoon 2.0 | GND | GND | /storage/Chrome/croc.bmp
bPlace: LOGIC | LOGIC | MS5607 | 5V | 22uF | BATT | 47uF | BATT | 100nF | 1uF | 1uF | 3.3V | FB | FB | 22pF | 22pF | 22pF | 18pF | GPS | 22pF | GND | GND | GND
209bmp: /storage/Chrome/croc.bmp